# Altium schematic sheet Proxxon.SchDoc
size A4
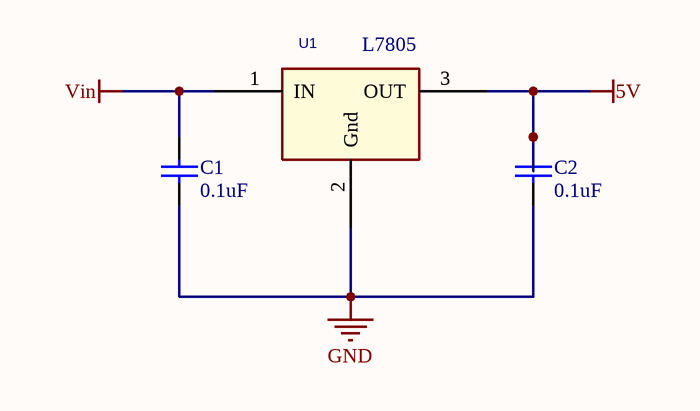
[diagram p0: Proxxon.SchDoc]

## Parts
C1  0.1uF  [CERCAP SMD0603L (IPC1608L)]
C2  0.1uF  [CERCAP SMD0603L (IPC1608L)]
U1  L7805  [DPAK - duplicate]

## Nets
5V: C2.1 U1.3(OUT)
GND: C1.2 C2.2 U1.2(Gnd)
Vin: C1.1 U1.1(IN)

## Library data of the parts
C1 C2 = Cap Semi: Capacitor (Semiconductor SIM Model); Published: 8-Jun-2000; LatestRevisionDate: 29-May-2009; LatestRevisionNote: IPC-7351 Footprint Added.; PackageReference: C1206; Publisher: Altium Limited; PackageDescription: Chip Capacitor; Value: 0.1uF
U1 = 7805